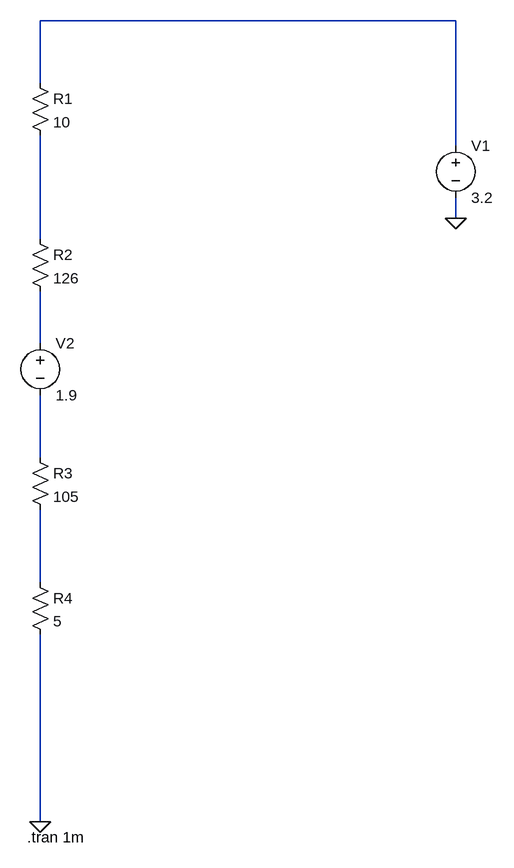
[diagram p0: schematic MIDI_3_3V.asc]
MIDI_3_3V.asc, the LTspice schematic file:
Version 4
SHEET 1 928 680
WIRE 832 -928 192 -928
WIRE 192 -832 192 -928
WIRE 832 -736 832 -928
WIRE 832 -624 832 -656
WIRE 192 -592 192 -752
WIRE 192 -432 192 -512
WIRE 192 -256 192 -352
WIRE 192 -64 192 -176
WIRE 192 304 192 16
FLAG 192 304 0
FLAG 832 -624 0
SYMBOL voltage 832 -752 R0
WINDOW 123 0 0 Left 2
WINDOW 39 0 0 Left 2
SYMATTR InstName V1
SYMATTR Value 3.2
SYMBOL res 176 -848 R0
SYMATTR InstName R1
SYMATTR Value 10
SYMATTR SpiceLine tol=5
SYMBOL res 176 -608 R0
SYMATTR InstName R2
SYMATTR Value 126
SYMATTR SpiceLine tol=5
SYMBOL res 176 -272 R0
SYMATTR InstName R3
SYMATTR Value 105
SYMATTR SpiceLine tol=5
SYMBOL res 176 -80 R0
SYMATTR InstName R4
SYMATTR Value 5
SYMATTR SpiceLine tol=5
SYMBOL voltage 192 -448 R0
WINDOW 123 0 0 Left 2
WINDOW 39 0 0 Left 2
SYMATTR InstName V2
SYMATTR Value 1.9
TEXT 172 328 Left 2 !.tran 1m

The netlist it stands for:
* MIDI_3_3V.asc
V1 N001 0 3.2
R1 N001 N002 10 tol=5
R2 N002 N003 126 tol=5
R3 N004 N005 105 tol=5
R4 N005 0 5 tol=5
V2 N003 N004 1.9
.tran 1m
.backanno
.end